# Altium schematic sheet [8] RK3399_SDIO_SPI_GPIOs.SchDoc: RK3399, SDIO, SPI and GPIOs
size B; DocumentNumber: I; Revision: 01; SheetNumber: 8; SheetTotal: 19
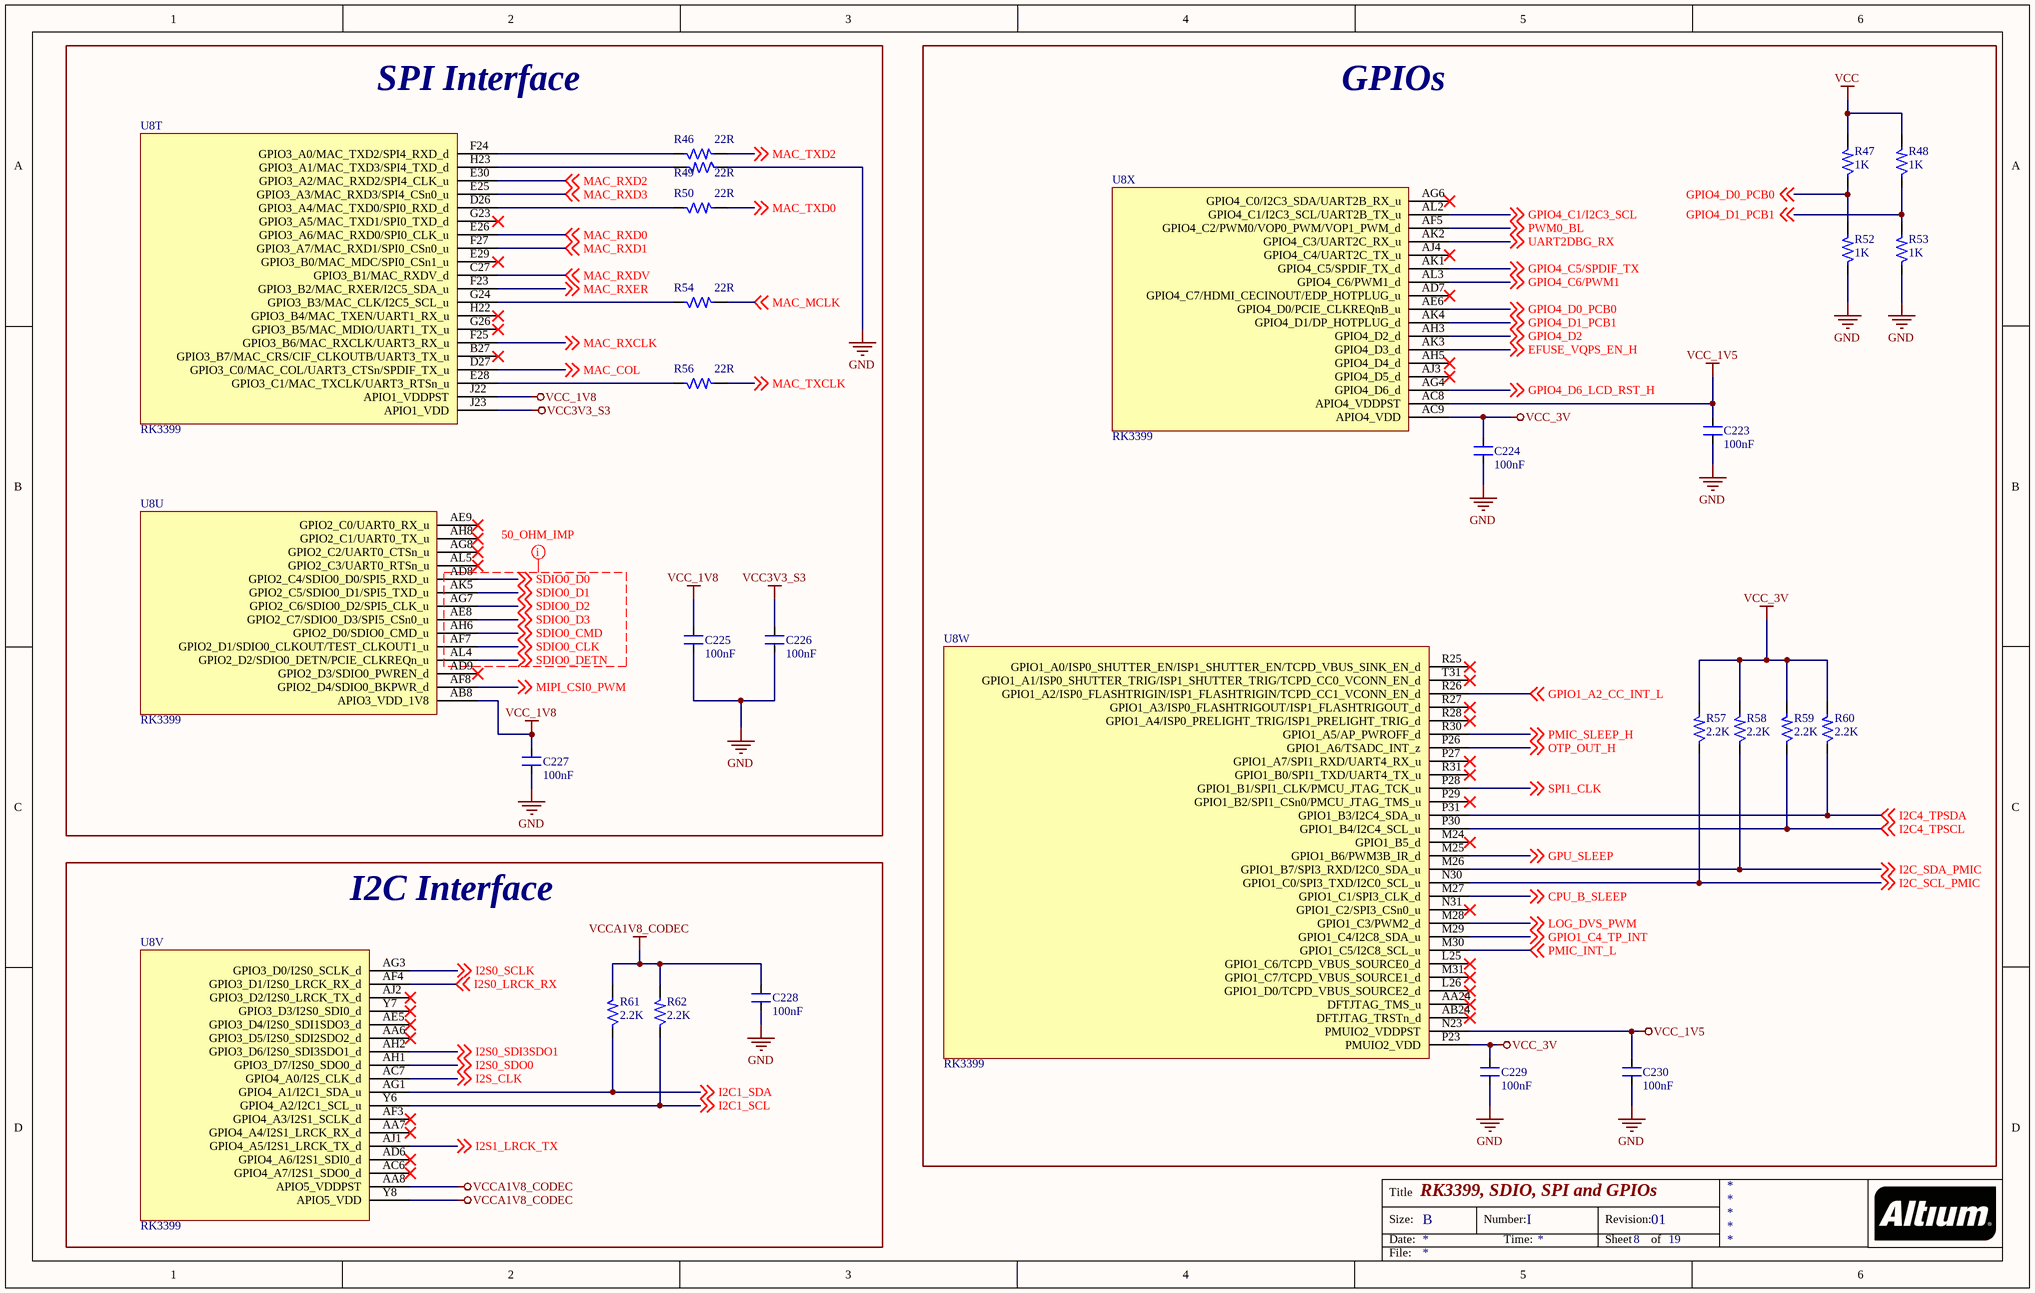
[diagram p0: [8] RK3399_SDIO_SPI_GPIOs.SchDoc]

## Parts
C223  100nF  [CAP_0201]
C224  100nF  [CAP_0201]
C225  100nF  [CAP_0201]
C226  100nF  [CAP_0201]
C227  100nF  [CAP_0201]
C228  100nF  [CAP_0201]
C229  100nF  [CAP_0201]
C230  100nF  [CAP_0201]
R46  22R  [RES_0201]
R47  1K  [RES_0201]
R48  1K  [RES_0201]
R49  22R  [RES_0201]
R50  22R  [RES_0201]
R52  1K  [RES_0402]
R53  1K  [RES_0402]
R54  22R  [RES_0201]
R56  22R  [RES_0201]
R57  2.2K  [RES_0201]
R58  2.2K  [RES_0201]
R59  2.2K  [RES_0201]
R60  2.2K  [RES_0201]
R61  2.2K  [RES_0201]
R62  2.2K  [RES_0201]
U8  RK3399  [FBGA828_23_826X826]  (parts T,U,V,W,X of 24)

## Blocks framed on the sheet
SPI Interface: C225-C227 R46 R49 R50 R54 R56 U8
GPIOs: C223 C224 C229 C230 R47 R48 R52 R53 R57-R60 U8
I2C Interface: C228 R61 R62 U8

## Nets
GND: C223.1 C224.1 C225.1 C226.1 C227.1 C228.1 C229.1 C230.1 R49.1 R52.1 R53.1
VCC: R47.2 R48.2
VCC3V3_S3: C226.2 U8.J23(APIO1_VDD)
VCC_1V5: C223.2 C230.2 U8.AC8(APIO4_VDDPST) U8.N23(PMUIO2_VDDPST)
VCC_1V8: C225.2 C227.2 U8.AB8(APIO3_VDD_1V8) U8.J22(APIO1_VDDPST)
VCC_3V: C224.2 C229.2 R57.2 R58.2 R59.2 R60.2 U8.AC9(APIO4_VDD) U8.P23(PMUIO2_VDD)
VCCA1V8_CODEC: C228.2 R61.2 R62.2 U8.AA8(APIO5_VDDPST) U8.Y8(APIO5_VDD)
CPU_B_SLEEP: U8.M27(GPIO1_C1/SPI3_CLK_d) ; off-sheet CPU_B_SLEEP
EFUSE_VQPS_EN_H: U8.AK3(GPIO4_D3_d) ; off-sheet EFUSE_VQPS_EN_H
GPIO1_A2_CC_INT_L: U8.R26(GPIO1_A2/ISP0_FLASHTRIGIN/ISP1_FLASHTRIGIN/TCPD_CC1_VCONN_EN_d) ; off-sheet GPIO1_A2_CC_INT_L
GPIO1_C4_TP_INT: U8.M29(GPIO1_C4/I2C8_SDA_u) ; off-sheet GPIO1_C4_TP_INT
GPIO4_C1/I2C3_SCL: U8.AL2(GPIO4_C1/I2C3_SCL/UART2B_TX_u) ; off-sheet GPIO4_C1/I2C3_SCL
GPIO4_C5/SPDIF_TX: U8.AK1(GPIO4_C5/SPDIF_TX_d) ; off-sheet GPIO4_C5/SPDIF_TX
GPIO4_C6/PWM1: U8.AL3(GPIO4_C6/PWM1_d) ; off-sheet GPIO4_C6/PWM1
GPIO4_D0_PCB0: R47.1 R52.2 U8.AE6(GPIO4_D0/PCIE_CLKREQnB_u) ; off-sheet GPIO4_D0_PCB0
GPIO4_D1_PCB1: R48.1 R53.2 U8.AK4(GPIO4_D1/DP_HOTPLUG_d) ; off-sheet GPIO4_D1_PCB1
GPIO4_D2: U8.AH3(GPIO4_D2_d) ; off-sheet GPIO4_D2
GPIO4_D6_LCD_RST_H: U8.AG4(GPIO4_D6_d) ; off-sheet GPIO4_D6_LCD_RST_H
GPU_SLEEP: U8.M25(GPIO1_B6/PWM3B_IR_d) ; off-sheet GPU_SLEEP
I2C1_SCL: R62.1 U8.Y6(GPIO4_A2/I2C1_SCL_u) ; off-sheet I2C1_SCL
I2C1_SDA: R61.1 U8.AG1(GPIO4_A1/I2C1_SDA_u) ; off-sheet I2C1_SDA
I2C4_TPSCL: R59.1 U8.P30(GPIO1_B4/I2C4_SCL_u) ; off-sheet I2C4_TPSCL
I2C4_TPSDA: R60.1 U8.P31(GPIO1_B3/I2C4_SDA_u) ; off-sheet I2C4_TPSDA
I2C_SCL_PMIC: R57.1 U8.N30(GPIO1_C0/SPI3_TXD/I2C0_SCL_u) ; off-sheet I2C_SCL_PMIC
I2C_SDA_PMIC: R58.1 U8.M26(GPIO1_B7/SPI3_RXD/I2C0_SDA_u) ; off-sheet I2C_SDA_PMIC
I2S0_LRCK_RX: U8.AF4(GPIO3_D1/I2S0_LRCK_RX_d) ; off-sheet I2S0_LRCK_RX
I2S0_SCLK: U8.AG3(GPIO3_D0/I2S0_SCLK_d) ; off-sheet I2S0_SCLK
I2S0_SDI3SDO1: U8.AH2(GPIO3_D6/I2S0_SDI3SDO1_d) ; off-sheet I2S0_SDI3SDO1
I2S0_SDO0: U8.AH1(GPIO3_D7/I2S0_SDO0_d) ; off-sheet I2S0_SDO0
I2S1_LRCK_TX: U8.AJ1(GPIO4_A5/I2S1_LRCK_TX_d) ; off-sheet I2S1_LRCK_TX
I2S_CLK: U8.AC7(GPIO4_A0/I2S_CLK_d) ; off-sheet I2S_CLK
LOG_DVS_PWM: U8.M28(GPIO1_C3/PWM2_d) ; off-sheet LOG_DVS_PWM
MAC_COL: U8.D27(GPIO3_C0/MAC_COL/UART3_CTSn/SPDIF_TX_u) ; off-sheet MAC_COL
MAC_MCLK: R54.2 ; off-sheet MAC_MCLK
MAC_RXCLK: U8.F25(GPIO3_B6/MAC_RXCLK/UART3_RX_u) ; off-sheet MAC_RXCLK
MAC_RXD0: U8.E26(GPIO3_A6/MAC_RXD0/SPI0_CLK_u) ; off-sheet MAC_RXD0
MAC_RXD1: U8.F27(GPIO3_A7/MAC_RXD1/SPI0_CSn0_u) ; off-sheet MAC_RXD1
MAC_RXD2: U8.E30(GPIO3_A2/MAC_RXD2/SPI4_CLK_u) ; off-sheet MAC_RXD2
MAC_RXD3: U8.E25(GPIO3_A3/MAC_RXD3/SPI4_CSn0_u) ; off-sheet MAC_RXD3
MAC_RXDV: U8.C27(GPIO3_B1/MAC_RXDV_d) ; off-sheet MAC_RXDV
MAC_RXER: U8.F23(GPIO3_B2/MAC_RXER/I2C5_SDA_u) ; off-sheet MAC_RXER
MAC_TXCLK: R56.2 ; off-sheet MAC_TXCLK
MAC_TXD0: R50.2 ; off-sheet MAC_TXD0
MAC_TXD2: R46.2 ; off-sheet MAC_TXD2
MIPI_CSI0_PWM: U8.AF8(GPIO2_D4/SDIO0_BKPWR_d) ; off-sheet MIPI_CSI0_PWM
OTP_OUT_H: U8.P26(GPIO1_A6/TSADC_INT_z) ; off-sheet OTP_OUT_H
PMIC_INT_L: U8.M30(GPIO1_C5/I2C8_SCL_u) ; off-sheet PMIC_INT_L
PMIC_SLEEP_H: U8.R30(GPIO1_A5/AP_PWROFF_d) ; off-sheet PMIC_SLEEP_H
PWM0_BL: U8.AF5(GPIO4_C2/PWM0/VOP0_PWM/VOP1_PWM_d) ; off-sheet PWM0_BL
SDIO0_CLK: U8.AF7(GPIO2_D1/SDIO0_CLKOUT/TEST_CLKOUT1_u) ; off-sheet SDIO0_CLK
SDIO0_CMD: U8.AH6(GPIO2_D0/SDIO0_CMD_u) ; off-sheet SDIO0_CMD
SDIO0_D0: U8.AD8(GPIO2_C4/SDIO0_D0/SPI5_RXD_u) ; off-sheet SDIO0_D0
SDIO0_D1: U8.AK5(GPIO2_C5/SDIO0_D1/SPI5_TXD_u) ; off-sheet SDIO0_D1
SDIO0_D2: U8.AG7(GPIO2_C6/SDIO0_D2/SPI5_CLK_u) ; off-sheet SDIO0_D2
SDIO0_D3: U8.AE8(GPIO2_C7/SDIO0_D3/SPI5_CSn0_u) ; off-sheet SDIO0_D3
SDIO0_DETN: U8.AL4(GPIO2_D2/SDIO0_DETN/PCIE_CLKREQn_u) ; off-sheet SDIO0_DETN
SPI1_CLK: U8.P28(GPIO1_B1/SPI1_CLK/PMCU_JTAG_TCK_u) ; off-sheet SPI1_CLK
UART2DBG_RX: U8.AK2(GPIO4_C3/UART2C_RX_u) ; off-sheet UART2DBG_RX
NetR46_1: R46.1 U8.F24(GPIO3_A0/MAC_TXD2/SPI4_RXD_d)
NetR49_2: R49.2 U8.H23(GPIO3_A1/MAC_TXD3/SPI4_TXD_d)
NetR50_1: R50.1 U8.D26(GPIO3_A4/MAC_TXD0/SPI0_RXD_d)
NetR54_1: R54.1 U8.G24(GPIO3_B3/MAC_CLK/I2C5_SCL_u)
NetR56_1: R56.1 U8.E28(GPIO3_C1/MAC_TXCLK/UART3_RTSn_u)

Not connected (* = marked no-connect by the designer): U8 AA6(GPIO3_D5/I2S0_SDI2SDO2_d)* AA7(GPIO4_A4/I2S1_LRCK_RX_d)* AA24(DFTJTAG_TMS_u)* AB24(DFTJTAG_TRSTn_d)* AC6(GPIO4_A7/I2S1_SDO0_d)* AD6(GPIO4_A6/I2S1_SDI0_d)* AD7(GPIO4_C7/HDMI_CECINOUT/EDP_HOTPLUG_u)* AD9(GPIO2_D3/SDIO0_PWREN_d)* AE5(GPIO3_D4/I2S0_SDI1SDO3_d)* AE9(GPIO2_C0/UART0_RX_u)* AF3(GPIO4_A3/I2S1_SCLK_d)* AG6(GPIO4_C0/I2C3_SDA/UART2B_RX_u)* AG8(GPIO2_C2/UART0_CTSn_u)* AH5(GPIO4_D4_d)* AH8(GPIO2_C1/UART0_TX_u)* AJ2(GPIO3_D2/I2S0_LRCK_TX_d)* AJ3(GPIO4_D5_d)* AJ4(GPIO4_C4/UART2C_TX_u)* AL5(GPIO2_C3/UART0_RTSn_u)* B27(GPIO3_B7/MAC_CRS/CIF_CLKOUTB/UART3_TX_u)* E29(GPIO3_B0/MAC_MDC/SPI0_CSn1_u)* G23(GPIO3_A5/MAC_TXD1/SPI0_TXD_d)* G26(GPIO3_B5/MAC_MDIO/UART1_TX_u)* H22(GPIO3_B4/MAC_TXEN/UART1_RX_u)* L25(GPIO1_C6/TCPD_VBUS_SOURCE0_d)* L26(GPIO1_D0/TCPD_VBUS_SOURCE2_d)* M24(GPIO1_B5_d)* M31(GPIO1_C7/TCPD_VBUS_SOURCE1_d)* N31(GPIO1_C2/SPI3_CSn0_u)* P27(GPIO1_A7/SPI1_RXD/UART4_RX_u)* P29(GPIO1_B2/SPI1_CSn0/PMCU_JTAG_TMS_u)* R25(GPIO1_A0/ISP0_SHUTTER_EN/ISP1_SHUTTER_EN/TCPD_VBUS_SINK_EN_d)* R27(GPIO1_A3/ISP0_FLASHTRIGOUT/ISP1_FLASHTRIGOUT_d)* R28(GPIO1_A4/ISP0_PRELIGHT_TRIG/ISP1_PRELIGHT_TRIG_d)* R31(GPIO1_B0/SPI1_TXD/UART4_TX_u)* T31(GPIO1_A1/ISP0_SHUTTER_TRIG/ISP1_SHUTTER_TRIG/TCPD_CC0_VCONN_EN_d)* Y7(GPIO3_D3/I2S0_SDI0_d)*

## Layout directives
net class 50_OHM_IMP: SDIO0_CLK, SDIO0_CMD, SDIO0_D0, SDIO0_D1, SDIO0_D2, SDIO0_D3, SDIO0_DETN

## Notes on the sheet
- Title
- Size:
- Date:
- B
- Number:
- Time:
- Revision:
- Sheet
- of
- File:

## Library data of the parts
C223-C230 = CAP_100nF-25V-10%-0201: 0.1µF ±10% 25V Ceramic Capacitor X5R 0201 (0603 Metric) /; Manufacturer: TDK Corporation; Manufacturer Part Number: C0603X5R1E104K030BB; Case/Package: 0201; Supplier-1: Digikey
R46 R49 R50 R54 R56 = RES_22R-0.05W-1%-0201: 22 Ohms ±1% 0.05W, 1/20W Chip Resistor 0201 (0603 Metric) Moisture Resistant Thick Film /; Manufacturer: Yageo; Manufacturer Part Number: RC0201FR-0722RL; Case/Package: 0201; Supplier-1: Digikey
R47 R48 = RES_1K-0.05W-1%-0201: 1 kOhms ±1% 0.05W, 1/20W Chip Resistor 0201 (0603 Metric) Thick Film /; Manufacturer: Yageo; Manufacturer Part Number: RC0201FR-071KL; Case/Package: 0201; Supplier-1: Digikey
R52 R53 = RES_1K-0.1W-1%-0402: 1 kOhms ±1% 0.1W, 1/10W Chip Resistor 0402 (1005 Metric) Anti-Sulfur Thin Film /; Manufacturer: Vishay Beyschlag/Draloric/BC Components; Manufacturer Part Number: MCS04020C1001FE000; Case/Package: 0402; Supplier-1: Digikey
R57-R62 = RES_2.2K-0.05W-1%-0201: 2.2 kOhms ±1% 0.05W, 1/20W Chip Resistor 0201 (0603 Metric) Thick Film /; Manufacturer: Stackpole Electronics Inc; Manufacturer Part Number: RMCF0201FT2K20; Case/Package: 0201; Supplier-1: Digikey
U8 = IC_RK3399-FCBGA828: RK3399 is a low power, high performance processor for computing, personal mobile.; Manufacturer: Rockchip; Manufacturer Part Number: RK3399; Case/Package: FCBGA828; Supplier-1: Rockchip